# EAGLE design psu (EAGLE 7.3.0)
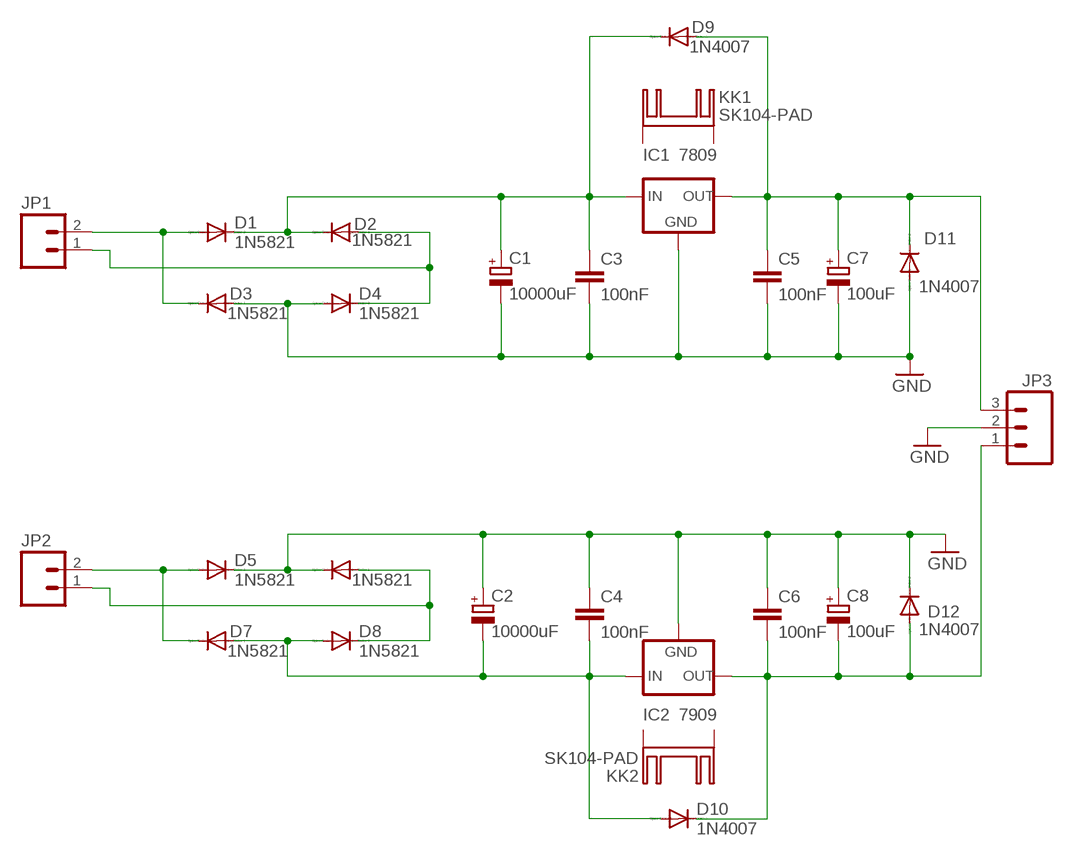
[diagram p0: schematic, sheet 1]

## Parts
C1  10000uF  CPOL-EUE7.5-18  [E7,5-18]
C2  10000uF  CPOL-EUE7.5-18  [E7,5-18]
C3  100nF  C-EU025-025X050  [C025-025X050]
C4  100nF  C-EU025-025X050  [C025-025X050]
C5  100nF  C-EU025-025X050  [C025-025X050]
C6  100nF  C-EU025-025X050  [C025-025X050]
C7  100uF  CPOL-EUE2.5-7  [E2,5-7]
C8  100uF  CPOL-EUE2.5-7  [E2,5-7]
D1  1N5821  [DO201-15]
D2  1N5821  [DO201-15]
D3  1N5821  [DO201-15]
D4  1N5821  [DO201-15]
D5  1N5821  [DO201-15]
D6  1N5821  [DO201-15]
D7  1N5821  [DO201-15]
D8  1N5821  [DO201-15]
D9  1N4007  [DO41-10]
D10  1N4007  [DO41-10]
D11  1N4007  [DO41-10]
D12  1N4007  [DO41-10]
IC1  7809  78XXS  [78XXS]
IC2  7909  79XXS  [79XXS]
JP1  M025MM  [SCREWTERMINAL-5MM-2]
JP2  M025MM  [SCREWTERMINAL-5MM-2]
JP3  M03-SCREW-5MM  [SCREWTERMINAL-5MM-3]
KK1  SK104-PAD  [SK104-PAD]
KK2  SK104-PAD  [SK104-PAD]

## Nets
GND: C1.- C2.+ C3.2 C4.1 C5.2 C6.1 C7.- C8.+ D3.A D4.A D5.C D6.C D11.A D12.C IC1.GND IC2.GND JP3.2
IN1_AC_A: D1.A D3.C JP1.2
IN1_AC_B: D2.A D4.C JP1.1
IN2_AC_A: D5.A D7.C JP2.2
IN2_AC_B: D6.A D8.C JP2.1
N$1: C1.+ C3.1 D1.C D2.C D9.C IC1.IN
N$8: C2.- C4.2 D7.A D8.A D10.A IC2.IN
OUT_NEG: C6.2 C8.- D10.C D12.A IC2.OUT JP3.1
OUT_POS: C5.1 C7.+ D9.A D11.C IC1.OUT JP3.3
Unconnected: KK1.K1(K) KK1.K2(K) KK2.K1(K) KK2.K2(K)

## Library data of the parts
C1 C2 C7 C8 = rcl:CPOL-EU: POLARIZED CAPACITOR, European symbol
C3-C6 = rcl:C-EU: CAPACITOR, European symbol
D1-D8 = diode:1N5821: DIODE Schottky barrier rectifier, 3 A, 30 V On Semi
D9-D12 = diode:1N4007: DIODE general purpose rectifier, 1 A
IC1 = v-reg:78XXS: VOLTAGE REGULATOR
IC2 = v-reg:79XXS: VOLTAGE REGULATOR
JP1 JP2 = SparkFun-Connectors:M02: Standard 2-pin 0.1" header. Use with - straight break away headers ( PRT-00116) - right angle break away headers (PRT-00553) - swiss pins (PRT-00743) - machine pins (PRT-00117) - female headers (PRT-00115) Molex polarized connector foot print use with: PRT-08233 with associated crimp pins and housings. 2.54_SCREWTERM for use with PRT-10571. 3.5mm Screw Terminal footprints for PRT-08084 5mm Screw Terminal footprints for use with PRT-08432; STOREFRONT_ID: PRT-08432
JP3 = SparkFun-Connectors:M03: Header 3 Standard 3-pin 0.1" header. Use with straight break away headers (SKU : PRT-00116), right angle break away headers (PRT-00553), swiss pins (PRT-00743), machine pins (PRT-00117), and female headers (PRT-00115). Molex polarized connector foot print use with SKU : PRT-08232 with associated crimp pins and housings.; STOREFRONT_ID: PRT-08433
KK1 KK2 = heatsink:SK104-PAD: HEATSINK manufacturer Fischer/distributor Buerklin

## Board
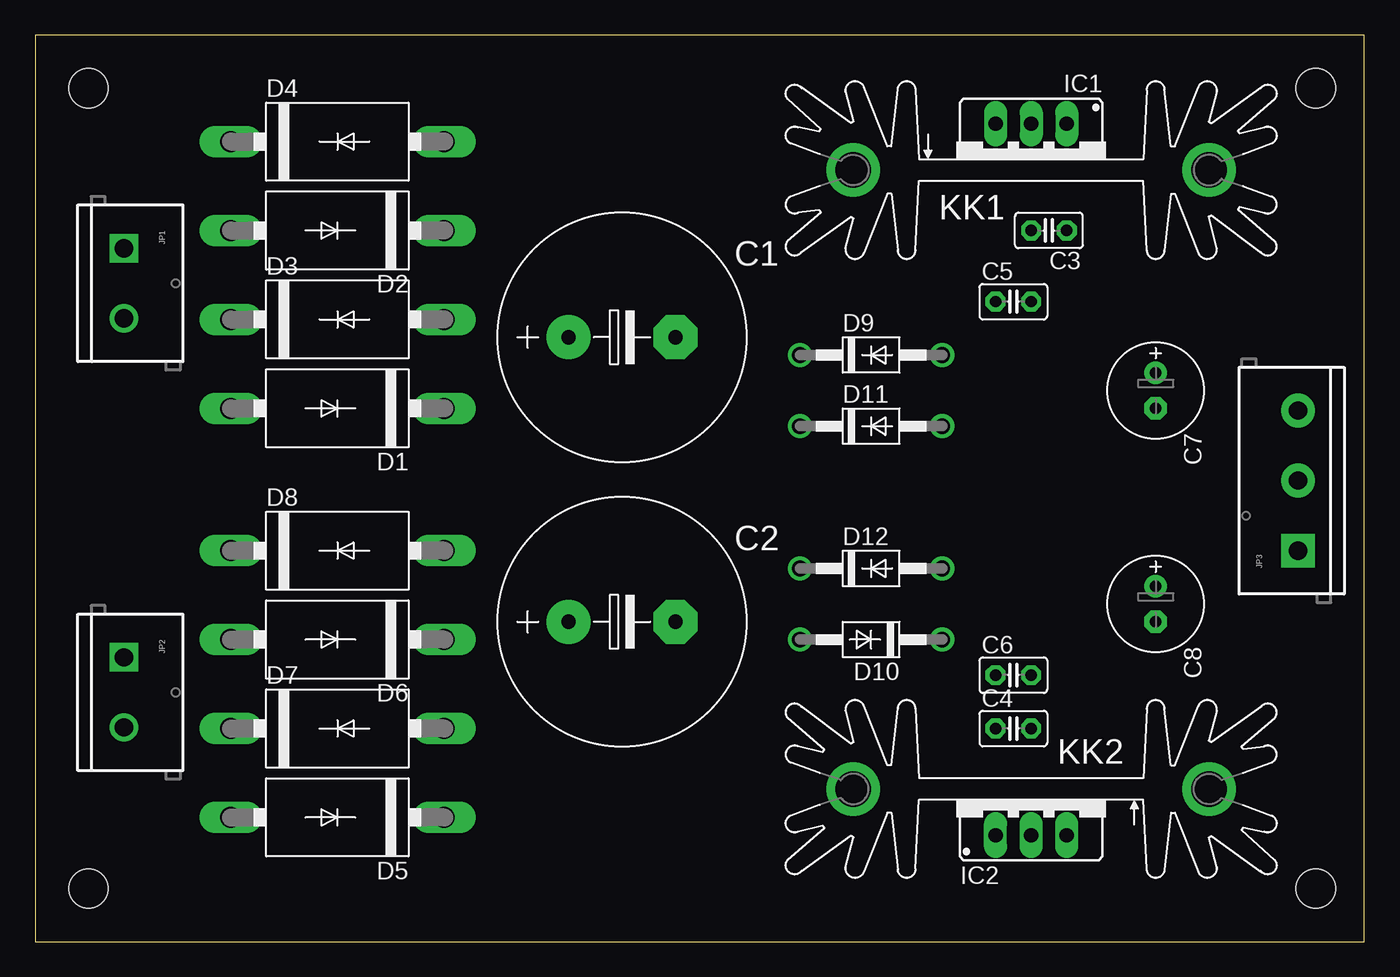
[diagram p1: board, top side]
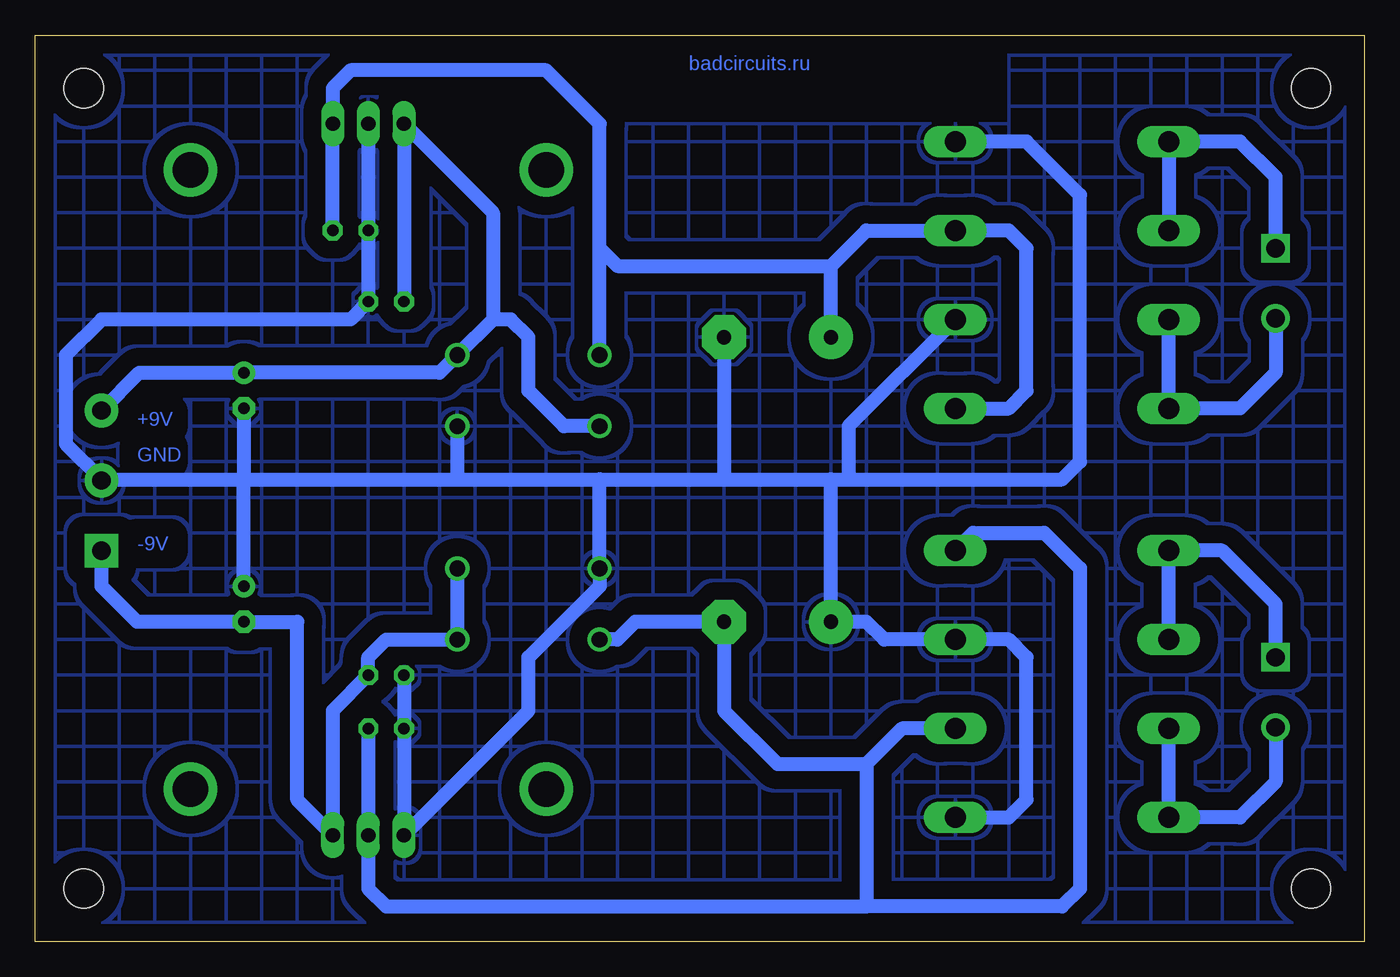
[diagram p2: board, bottom side, seen from below]

Size 94.92 x 64.76 mm. Coordinates in mm from the lower left corner, seen from the top.
Outline: 0,0 94.92,0 94.92,64.76 0,64.76 0,0
Copper layers (1*16): Top 0.035mm / dielectric 1.5mm / Bottom 0.035mm
Design rules "default *": minimum track width 20mil, minimum drill 32mil, track to track 16mil, track to pad 16mil, pad to pad 12mil, via to via 16mil, smd to smd 12mil, copper to edge 40mil, drill to drill 40mil, minimum pad ring 12mil, minimum via ring 12mil, stop-mask expansion 4mil, vias tented up to drill 0mil, thermal gap 10mil
Holes 2.8 mm at 3.81,60.96 3.81,3.81 91.44,3.81 91.44,60.96

### Footprints (pad centres in the part's own frame; a part is rotated, then mirrored left to right if it is on the bottom)
E7,5-18 = drill 1.016 pad 3.15: + -3.81,0 | drill 1.016 pad 3.15 octagon: - 3.81,0
C025-025X050 = drill 0.813 octagon: 1 -1.27,0; 2 1.27,0
E2,5-7 = drill 0.813 pad 1.6: + -1.27,0 | drill 0.813 pad 1.6 octagon: - 1.27,0
DO201-15 = drill 1.499 long: A 7.62,0; C -7.62,0
DO41-10 = drill 1.118: A 5.08,0; C -5.08,0
78XXS = drill 1.016 long: GND 0,-2.54; IN -2.54,-2.54; OUT 2.54,-2.54
79XXS = drill 1.016 long: GND -2.54,-2.54; IN 0,-2.54; OUT 2.54,-2.54
SCREWTERMINAL-5MM-2 = drill 1.3 pad 2.032 square: 1 0,0 | drill 1.3 pad 2.032: 2 5,0
SCREWTERMINAL-5MM-3 = drill 1.3 pad 2.413 square: 1 0,0 | drill 1.3 pad 2.413: 2 5,0; 3 10,0
SK104-PAD = drill 2.54 pad 3.81: K1 -12.7,-0.762; K2 12.7,-0.762

### Placement (x,y rotation side)
C1  41.91,43.18 0 top
C2  41.91,22.86 0 top
C3  72.39,50.8 180 top
C4  69.85,15.24 0 top
C5  69.85,45.72 0 top
C6  69.85,19.05 0 top
C7  80.01,39.37 270 top
C8  80.01,24.13 270 top
D1  21.59,38.1 180 top
D2  21.59,50.8 180 top
D3  21.59,44.45 0 top
D4  21.59,57.15 0 top
D5  21.59,8.89 180 top
D6  21.59,21.59 180 top
D7  21.59,15.24 0 top
D8  21.59,27.94 0 top
D9  59.69,41.91 0 top
D10  59.69,21.59 180 top
D11  59.69,36.83 0 top
D12  59.69,26.67 0 top
IC1  71.12,55.88 180 top
IC2  71.12,10.16 0 top
JP1  6.35,49.53 270 top
JP2  6.35,20.32 270 top
JP3  90.17,27.94 90 top
KK1  71.12,55.88 0 top
KK2  71.12,10.16 180 top

### Tracks (layer width: path | path; a pad name or v marks a point on that pad's centre or on a via)
GND
  Bottom 1.016: 80.01,33.02 90.09,33.02 JP3.2 90.17,33.02 92.71,35.56 92.71,41.91 90.17,44.45 72.39,44.45 C5.2 C3.2 IC1.GND | 80.01,33.02 64.77,33.02 | 64.77,33.02 54.61,33.02 | 54.61,33.02 45.72,33.02 | 45.72,33.02 38.1,33.02 | 38.1,33.02 36.83,33.02 | 36.83,33.02 21.59,33.02 20.32,34.29 20.32,53.34 24.13,57.15 D4.A | D3.A 36.83,36.83 36.83,33.02 | D11.A 64.77,33.02 | D5.C 25.4,8.89 24.13,10.16 24.13,20.32 25.4,21.59 D6.C 34.29,21.59 35.56,22.86 C2.+ 38.1,33.02 | C7.- 80.01,33.02 | C8.+ 80.01,33.02 | C1.- 45.72,33.02 | C6.1 C4.1 IC2.GND 59.69,16.51 59.69,20.32 54.61,25.4 D12.C 54.61,33.02
  pour Bottom (isolate 1.27, hatched): 1.27,63.5 25.4,63.5 25.4,58.42 63.5,58.42 63.5,63.5 93.98,63.5 93.98,1.27 1.27,1.27
IN1_AC_A
  Bottom 1.016: JP1.2 6.35,40.64 8.89,38.1 D1.A D3.C
IN1_AC_B
  Bottom 1.016: JP1.1 6.35,54.61 8.89,57.15 D4.C D2.A
IN2_AC_A
  Bottom 1.016: JP2.2 6.35,11.43 8.89,8.89 D5.A D7.C
IN2_AC_B
  Bottom 1.016: JP2.1 6.35,24.13 10.16,27.94 D8.C D6.A
N$1
  Bottom 1.016: D1.C 25.4,38.1 24.13,39.37 24.13,49.53 25.4,50.8 D2.C 35.56,50.8 38.1,48.26 | D9.C 54.61,49.53 | 54.61,49.53 54.61,58.42 58.42,62.23 72.39,62.23 73.66,60.96 IC1.IN C3.1 | C1.+ 38.1,48.26 | 54.61,49.53 53.34,48.26 38.1,48.26
N$8
  Bottom 1.016: D8.A 27.94,29.21 22.86,29.21 20.32,26.67 20.32,3.81 21.59,2.54 35.56,2.54 | D7.A 33.02,15.24 35.56,12.7 | 35.56,12.7 35.56,2.54 | 35.56,2.54 69.85,2.54 71.12,3.81 IC2.IN C4.2 | 35.56,12.7 41.91,12.7 45.72,16.51 C2.- 52.07,22.86 53.34,21.59 D10.A
OUT_NEG
  Bottom 1.016: JP3.1 90.17,25.4 87.63,22.86 C8.- 76.2,22.86 76.2,10.16 IC2.OUT 73.66,16.51 C6.2 71.12,20.32 69.85,21.59 D10.C D12.A
OUT_POS
  Bottom 1.016: 62.23,44.45 D9.A 66.04,40.64 C7.+ 87.47,40.64 JP3.3 | 62.23,44.45 62.23,52.07 IC1.OUT C5.1 | D11.C 57.15,36.83 59.69,39.37 59.69,43.18 60.96,44.45 62.23,44.45

### Text on the board
Bottom: badcircuits.ru | +9V | GND | -9V